# Altium schematic sheet CF_ADC_Supply.SchDoc
size Tabloid; DocumentNumber: 7; SheetNumber: 7; SheetTotal: 10; Sheet_Name: CF_ADC_Supply; Size: 11x17
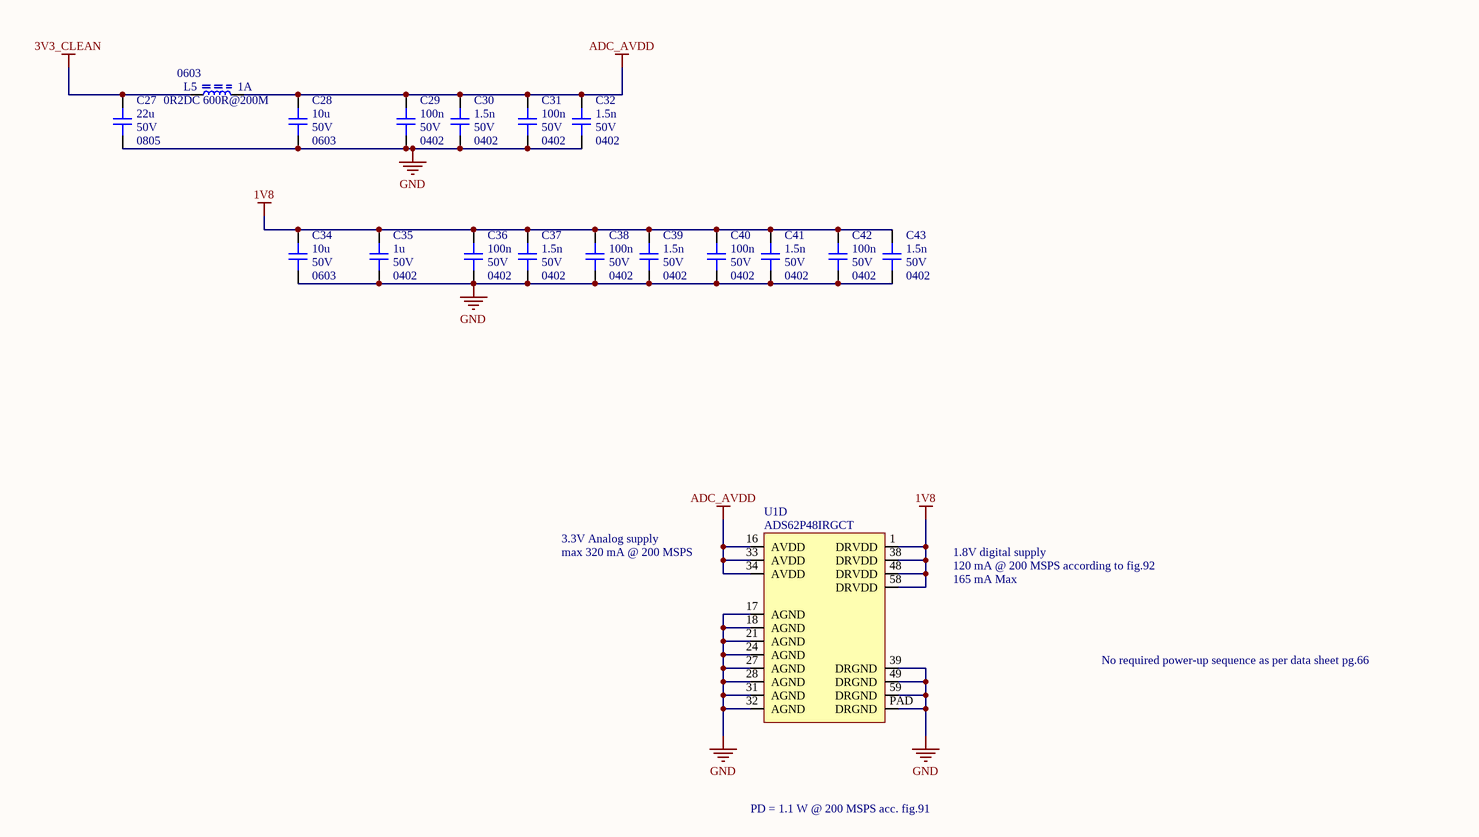
[diagram p0: CF_ADC_Supply.SchDoc]

## Parts
C27  value 22u  Voltage: 50V  Package: 0805  [CAP_0805]  (hidden comment: CAP - 0805)
C28  value 10u  Voltage: 50V  Package: 0603  [CAP_0603]  (hidden comment: CAP - 0603)
C29  value 100n  Voltage: 50V  Package: 0402  [CAP_0402]  (hidden comment: CAP - 0402)
C30  value 1.5n  Voltage: 50V  Package: 0402  [CAP_0402]  (hidden comment: CAP - 0402)
C31  value 100n  Voltage: 50V  Package: 0402  [CAP_0402]  (hidden comment: CAP - 0402)
C32  value 1.5n  Voltage: 50V  Package: 0402  [CAP_0402]  (hidden comment: CAP - 0402)
C34  value 10u  Voltage: 50V  Package: 0603  [CAP_0603]  (hidden comment: CAP - 0603)
C35  value 1u  Voltage: 50V  Package: 0402  [CAP_0402]  (hidden comment: CAP - 0402)
C36  value 100n  Voltage: 50V  Package: 0402  [CAP_0402]  (hidden comment: CAP - 0402)
C37  value 1.5n  Voltage: 50V  Package: 0402  [CAP_0402]  (hidden comment: CAP - 0402)
C38  value 100n  Voltage: 50V  Package: 0402  [CAP_0402]  (hidden comment: CAP - 0402)
C39  value 1.5n  Voltage: 50V  Package: 0402  [CAP_0402]  (hidden comment: CAP - 0402)
C40  value 100n  Voltage: 50V  Package: 0402  [CAP_0402]  (hidden comment: CAP - 0402)
C41  value 1.5n  Voltage: 50V  Package: 0402  [CAP_0402]  (hidden comment: CAP - 0402)
C42  value 100n  Voltage: 50V  Package: 0402  [CAP_0402]  (hidden comment: CAP - 0402)
C43  value 1.5n  Voltage: 50V  Package: 0402  [CAP_0402]  (hidden comment: CAP - 0402)
L5  value 0R2DC 600R@200M  Current: 1A  Package: 0603  [FER_0603]  (hidden comment: FER - 0603)
U1  ADS62P48IRGCT  [ADC_ADS62P48IRGCT]  (part D of 4)

## Nets
1V8: C34.2 C35.2 C36.2 C37.2 C38.2 C39.2 C40.2 C41.2 C42.2 C43.2 U1.1(DRVDD) U1.38(DRVDD) U1.48(DRVDD) U1.58(DRVDD)
3V3_CLEAN: C27.2 L5.2
ADC_AVDD: C28.2 C29.2 C30.2 C31.2 C32.2 L5.1 U1.16(AVDD) U1.33(AVDD) U1.34(AVDD)
GND: C27.1 C28.1 C29.1 C30.1 C31.1 C32.1 C34.1 C35.1 C36.1 C37.1 C38.1 C39.1 C40.1 C41.1 C42.1 C43.1 U1.17(AGND) U1.18(AGND) U1.21(AGND) U1.24(AGND) U1.27(AGND) U1.28(AGND) U1.31(AGND) U1.32(AGND) U1.39(DRGND) U1.49(DRGND) U1.59(DRGND) U1.PAD(DRGND)

## Notes on the sheet
- max 320 mA @ 200 MSPS
- 3.3V Analog supply
- 120 mA @ 200 MSPS according to fig.92
- 1.8V digital supply
- 165 mA Max
- No required power-up sequence as per data sheet pg.66
- PD = 1.1 W @ 200 MSPS acc. fig.91
- Sheet Name
- Project Title
- Global Project
- Size
- Group
- Revision
- Date
- Sheet
- of
- Filename
- Designers

## Library data of the parts
C27 = CAP - 0805: Precision: 10%; Current: *; CreatedBy: Jonathan Bouchard; Power: *
C28 C34 = CAP - 0603: Mfg Part Number: C1005X5R0J106M050BC; Precision: 10%; Current: *; CreatedBy: Jonathan Bouchard; Power: *
C29 C31 C36 C38 C40 C42 = CAP - 0402: Mfg Part Number: C0603X5R1E104K030BB; Precision: 10%; Current: *; CreatedBy: Jonathan Bouchard; Power: *
C30 C32 C37 C39 C41 C43 = CAP - 0402: Mfg Part Number: C0603X5R1E152M030BA; Precision: 10%; Current: *; CreatedBy: Jonathan Bouchard; Power: *
C35 = CAP - 0402: Mfg Part Number: C0603X5R0J105M030BC; Precision: 10%; Current: *; CreatedBy: Jonathan Bouchard; Power: *
L5 = FER - 0603: Mfg Part Number: 782633601; Mfg: Würth Elektronik; Voltage: *; CreatedBy: Jonathan Bouchard; Power: *; Precision: *
U1 = ADC_ADS62P48IRGCT: ADC - 14 BIT 210MSPS SUAL - VQFN-64; Voltage: 3.15 V ~ 3.6 V / 1.7 V ~ 1.9 V; Mfg: Texas Instruments; Precision: 14 Bit; Current: *; Power: *; Mfg Part Number: ADS62P48IRGCT; HelpURL: http://www.ti.com/lit/ds/symlink/ads62p48.pdf; CreatedBy: Jonathan Bouchard; Temperature: -40°C ~ 85°C; Value: *; Package: VQFN-64; Supplier 1: Digikey; Supplier Part Number 1: 296-24611-1-ND